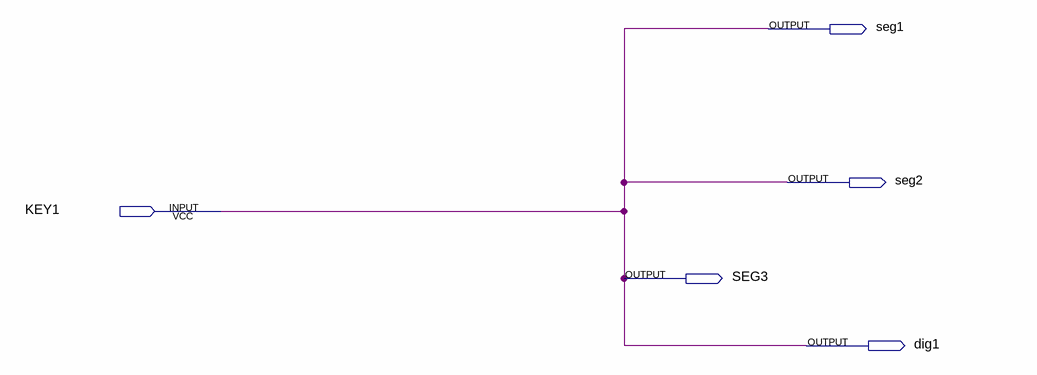
[diagram p0: schematic sheet]
// Quartus schematic testes.bdf as structural Verilog: 0 symbols, 5 pins
module testes (
  input  KEY1,
  output seg1,
  output seg2,
  output SEG3,
  output dig1
);


  assign dig1 = KEY1;
  assign seg1 = KEY1;
  assign seg2 = KEY1;
  assign SEG3 = KEY1;
endmodule
